# Altium schematic sheet Microcontroller.SchDoc: Microcontroller
size Letter; Date: 2017-02-19; Revision: A; SheetNumber: 3; SheetTotal: 6; ProjectTitle: CANwheel
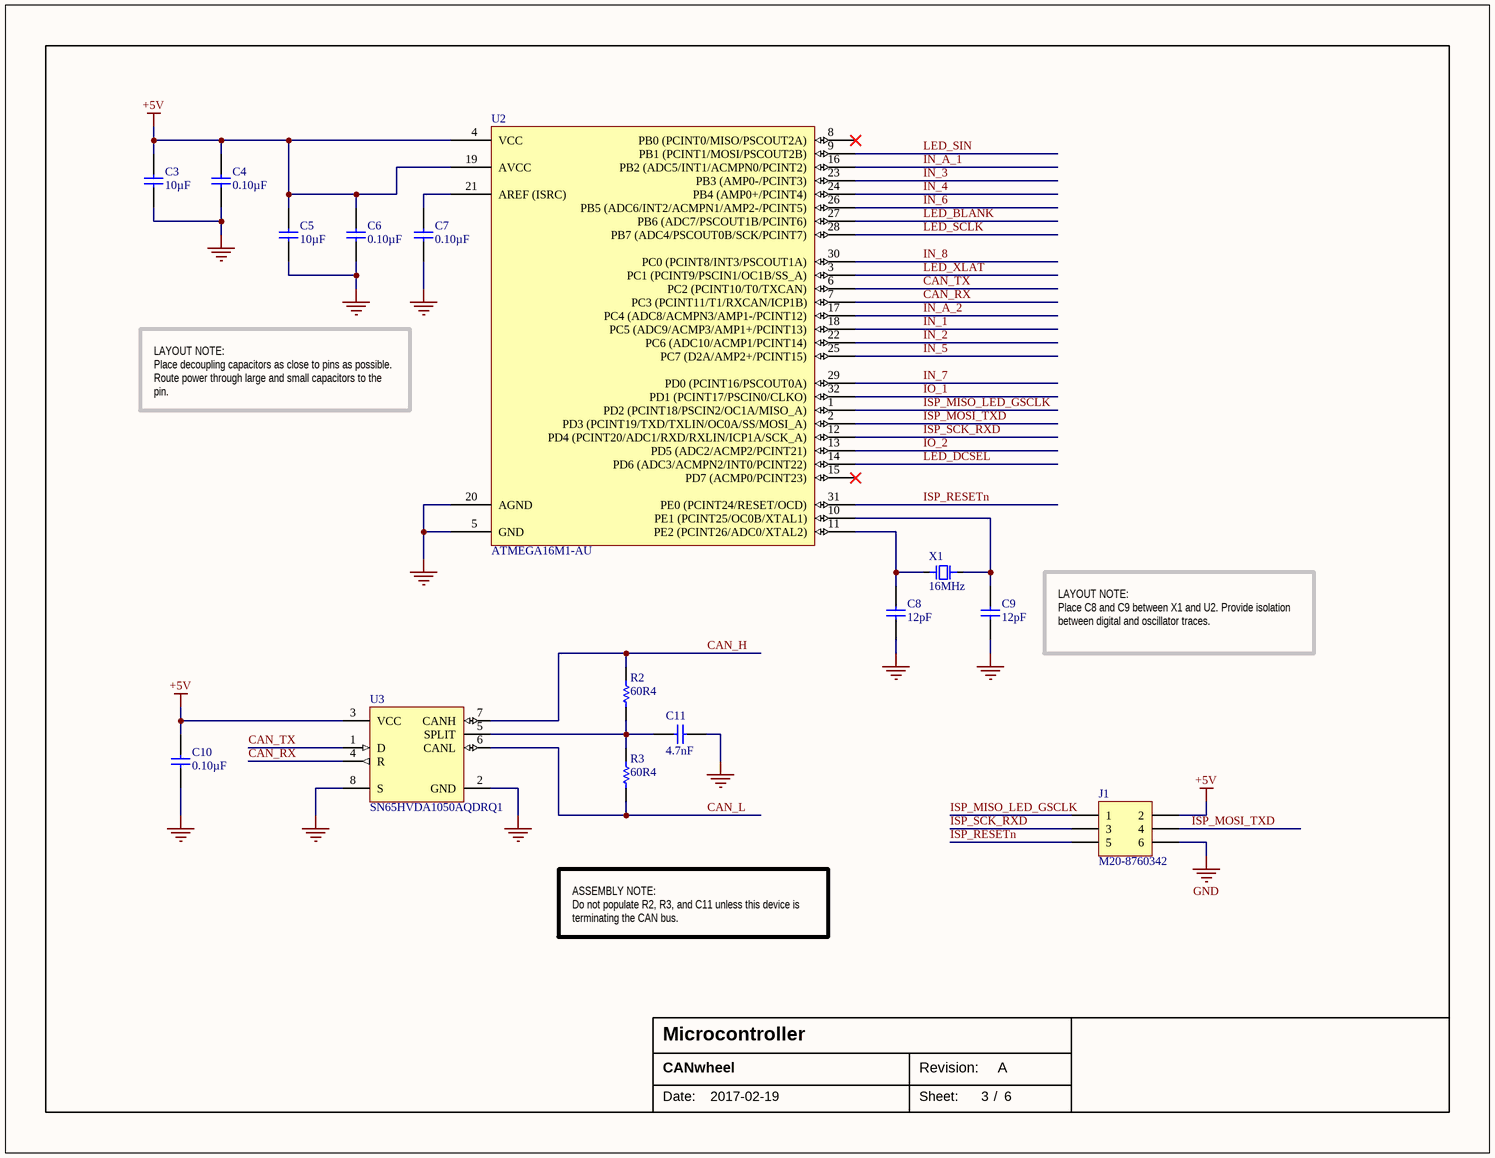
[diagram p0: Microcontroller.SchDoc]

## Parts
C3  value 10µF  [CAP-0805-M]  (hidden comment: CAP 10µF ±10% 6.3V 0805 X7R)
C4  value 0.10µF  [CAP-0402-M]  (hidden comment: CAP 0.10µF ±10% 6.3V 0402 X7R)
C5  value 10µF  [CAP-0805-M]  (hidden comment: CAP 10µF ±10% 6.3V 0805 X7R)
C6  value 0.10µF  [CAP-0402-M]  (hidden comment: CAP 0.10µF ±10% 6.3V 0402 X7R)
C7  value 0.10µF  [CAP-0402-M]  (hidden comment: CAP 0.10µF ±10% 6.3V 0402 X7R)
C8  value 12pF  [CAP-0402-M]  (hidden comment: CAP 12pF ±5% 50V 0402 C0G, NP0)
C9  value 12pF  [CAP-0402-M]  (hidden comment: CAP 12pF ±5% 50V 0402 C0G, NP0)
C10  value 0.10µF  [CAP-0402-M]  (hidden comment: CAP 0.10µF ±10% 6.3V 0402 X7R)
C11  value 4.7nF  [CAP-0402-M]  (hidden comment: CAP 4700pF ±10% 16V 0402 X7R)
J1  M20-8760342  [M20-8760342]
R2  value 60R4  [RES-0805-M]  (hidden comment: RES 60R4 1% 1/8 W 0805 ±100ppm/°C)
R3  value 60R4  [RES-0805-M]  (hidden comment: RES 60R4 1% 1/8 W 0805 ±100ppm/°C)
U2  ATMEGA16M1-AU  [TQFP80P900X900X120-32N]
U3  SN65HVDA1050AQDRQ1  [SOIC127P600X175-8M]
X1  value 16MHz  [SON127P500X135-2N]  (hidden comment: 7A-16.000MAAE-T)

## Nets
+5V: C3.1 C4.1 C5.1 C6.1 C10.1 J1.2 U2.4(VCC) U2.19(AVCC) U3.3(VCC)
GND: C3.2 C4.2 C5.2 C6.2 C7.2 C8.1 C9.1 C10.2 C11.1 J1.6 U2.5(GND) U2.20(AGND) U3.2(GND) U3.8(S)
CAN_H: R2.1 U3.7(CANH)
CAN_L: R3.1 U3.6(CANL)
CAN_RX: U2.7(PC3_(PCINT11/T1/RXCAN/ICP1B)) U3.4(R)
CAN_TX: U2.6(PC2_(PCINT10/T0/TXCAN)) U3.1(D)
IN_1: U2.18(PC5_(ADC9/ACMP3/AMP1+/PCINT13))
IN_2: U2.22(PC6_(ADC10/ACMP1/PCINT14))
IN_3: U2.23(PB3_(AMP0-/PCINT3))
IN_4: U2.24(PB4_(AMP0+/PCINT4))
IN_5: U2.25(PC7_(D2A/AMP2+/PCINT15))
IN_6: U2.26(PB5_(ADC6/INT2/ACMPN1/AMP2-/PCINT5))
IN_7: U2.29(PD0_(PCINT16/PSCOUT0A))
IN_8: U2.30(PC0_(PCINT8/INT3/PSCOUT1A))
IN_A_1: U2.16(PB2_(ADC5/INT1/ACMPN0/PCINT2))
IN_A_2: U2.17(PC4_(ADC8/ACMPN3/AMP1-/PCINT12))
IO_1: U2.32(PD1_(PCINT17/PSCIN0/CLKO))
IO_2: U2.13(PD5_(ADC2/ACMP2/PCINT21))
ISP_MISO_LED_GSCLK: J1.1 U2.1(PD2_(PCINT18/PSCIN2/OC1A/MISO_A))
ISP_MOSI_TXD: J1.4 U2.2(PD3_(PCINT19/TXD/TXLIN/OC0A/SS/MOSI_A))
ISP_RESETn: J1.5 U2.31(PE0_(PCINT24/RESET/OCD))
ISP_SCK_RXD: J1.3 U2.12(PD4_(PCINT20/ADC1/RXD/RXLIN/ICP1A/SCK_A))
LED_BLANK: U2.27(PB6_(ADC7/PSCOUT1B/PCINT6))
LED_DCSEL: U2.14(PD6_(ADC3/ACMPN2/INT0/PCINT22))
LED_SCLK: U2.28(PB7_(ADC4/PSCOUT0B/SCK/PCINT7))
LED_SIN: U2.9(PB1_(PCINT1/MOSI/PSCOUT2B))
LED_XLAT: U2.3(PC1_(PCINT9/PSCIN1/OC1B/SS_A))
NetC7_1: C7.1 U2.21(AREF_(ISRC))
NetC8_2: C8.2 U2.11(PE2_(PCINT26/ADC0/XTAL2)) X1.2
NetC9_2: C9.2 U2.10(PE1_(PCINT25/OC0B/XTAL1)) X1.1
NetC11_2: C11.2 R2.2 R3.2 U3.5(SPLIT)

Not connected (* = marked no-connect by the designer): U2 8(PB0_(PCINT0/MISO/PSCOUT2A))* 15(PD7_(ACMP0/PCINT23))*

## Notes on the sheet
- LAYOUT NOTE:
  Place decoupling capacitors as close to pins as possible. Route power through large and small capacitors to the pin.
- LAYOUT NOTE:
  Place C8 and C9 between X1 and U2. Provide isolation between digital and oscillator traces.
- ASSEMBLY NOTE:
  Do not populate R2, R3, and C11 unless this device is terminating the CAN bus.
- Date:
- Revision:
- Sheet:
- /

## Library data of the parts
C3 C5 = CC0805KKX7R5BB106: Manufacturer: Yageo; Manufacturer Series: CC; Part Number: CC0805KKX7R5BB106; Component Type: Standard; Tolerance: ±10%; Voltage: 6.3V; Package: 0805; Temperature Coefficient: X7R; Temperature Range: -55°C ~ 125°C; Supplier 1: Digi-Key; Supplier Part Number 1: 311-1877-1-ND
C4 C6 C7 C10 = CC0402KRX7R5BB104: Manufacturer: Yageo; Manufacturer Series: CC; Part Number: CC0402KRX7R5BB104; Component Type: Standard; Tolerance: ±10%; Voltage: 6.3V; Package: 0402; Temperature Coefficient: X7R; Temperature Range: -55°C ~ 125°C; Supplier 1: Digi-Key; Supplier Part Number 1: 311-1701-1-ND
C8 C9 = CC0402JRNPO9BN120: Manufacturer: Yageo; Manufacturer Series: CC; Part Number: CC0402JRNPO9BN120; Component Type: Standard; Tolerance: ±5%; Voltage: 50V; Package: 0402; Temperature Coefficient: C0G, NP0; Temperature Range: -55°C ~ 125°C; Supplier 1: Digi-Key; Supplier Part Number 1: 311-1016-1-ND
C11 = CC0402KRX7R7BB472: Manufacturer: Yageo; Manufacturer Series: CC; Part Number: CC0402KRX7R7BB472; Component Type: Standard; Tolerance: ±10%; Voltage: 16V; Package: 0402; Temperature Coefficient: X7R; Temperature Range: -55°C ~ 125°C; Supplier 1: Digi-Key; Supplier Part Number 1: 311-1709-1-ND
R2 R3 = RC0805FR-0760R4L: Manufacturer: Yageo; Manufacturer Series: RC; Power: 1/8 W; Part Number: RC0805FR-0760R4L; Component Type: Standard; Tolerance: 1%; Package: 0805; Temperature Coefficient: ±100ppm/°C; Temperature Range: -55°C ~ 155°C; Supplier 1: Digi-Key; Supplier Part Number 1: 311-60.4CRCT-ND
U2 = ATMEGA16M1-AU: ATmega16M1 32-QFP 7x7 mm
U3 = SN65HVDA1050AQDRQ1: CAN transceiver; Supplier 1: Digi-Key; Supplier Part Number 1: 296-25836-1-ND
X1 = 7A-16.000MAAE-T: SMD Crystal Oscillator 12 pF; Load Capacitance: 12pF; Supplier 1: Digi-Key; Supplier Part Number 1: 887-1747-1-ND